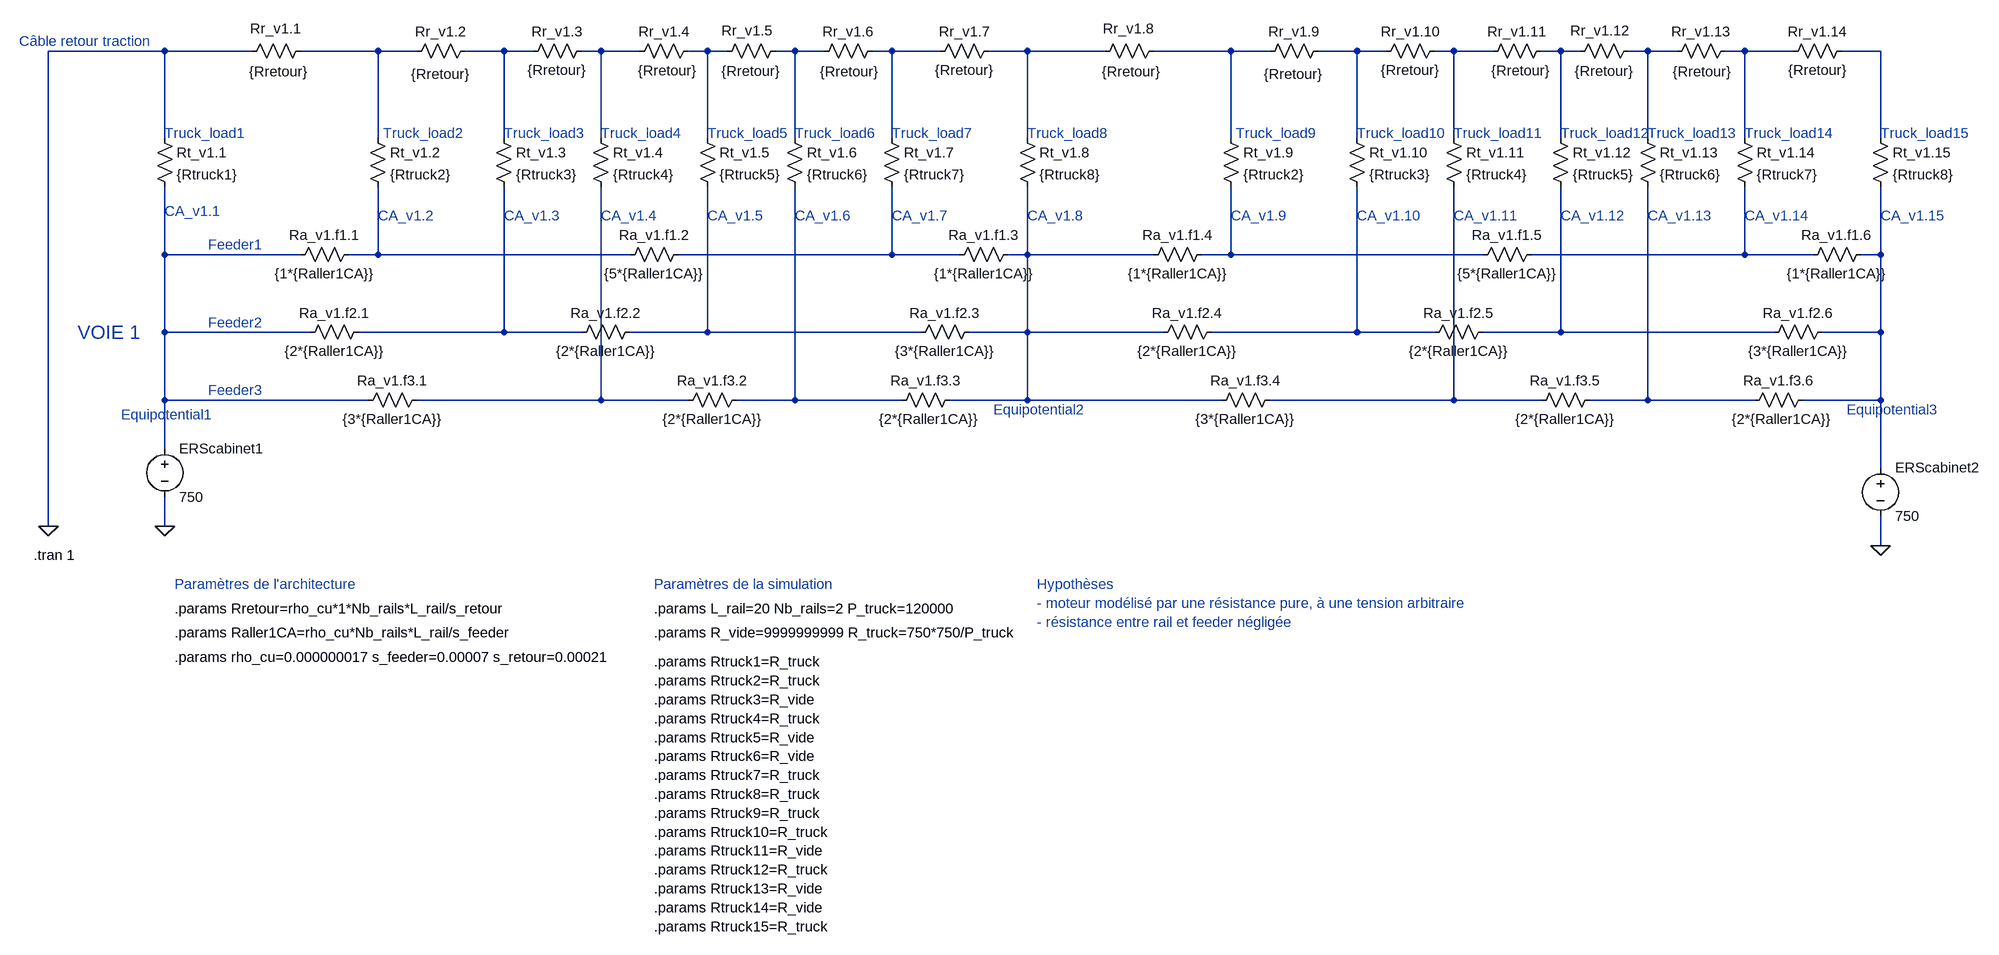
[diagram p0: schematic CA_sur_feeders.asc]
CA_sur_feeders.asc, the LTspice schematic file:
Version 4
SHEET 1 2976 1000
WIRE -48 -416 -240 -416
WIRE 96 -416 -48 -416
WIRE 304 -416 176 -416
WIRE 368 -416 304 -416
WIRE 512 -416 448 -416
WIRE 560 -416 512 -416
WIRE 672 -416 640 -416
WIRE 736 -416 672 -416
WIRE 848 -416 816 -416
WIRE 880 -416 848 -416
WIRE 992 -416 960 -416
WIRE 1040 -416 992 -416
WIRE 1152 -416 1120 -416
WIRE 1232 -416 1152 -416
WIRE 1376 -416 1312 -416
WIRE 1504 -416 1376 -416
WIRE 1712 -416 1584 -416
WIRE 1776 -416 1712 -416
WIRE 1920 -416 1856 -416
WIRE 1968 -416 1920 -416
WIRE 2080 -416 2048 -416
WIRE 2144 -416 2080 -416
WIRE 2256 -416 2224 -416
WIRE 2288 -416 2256 -416
WIRE 2400 -416 2368 -416
WIRE 2448 -416 2400 -416
WIRE 2560 -416 2528 -416
WIRE 2640 -416 2560 -416
WIRE 2784 -416 2720 -416
WIRE -48 -272 -48 -416
WIRE 304 -272 304 -416
WIRE 512 -272 512 -416
WIRE 672 -272 672 -416
WIRE 848 -272 848 -416
WIRE 992 -272 992 -416
WIRE 1152 -272 1152 -416
WIRE 1376 -272 1376 -416
WIRE 1712 -272 1712 -416
WIRE 1920 -272 1920 -416
WIRE 2080 -272 2080 -416
WIRE 2256 -272 2256 -416
WIRE 2400 -272 2400 -416
WIRE 2560 -272 2560 -416
WIRE 2784 -272 2784 -416
WIRE -48 -80 -48 -192
WIRE 176 -80 -48 -80
WIRE 304 -80 304 -192
WIRE 304 -80 256 -80
WIRE 720 -80 304 -80
WIRE 1152 -80 1152 -192
WIRE 1152 -80 800 -80
WIRE 1264 -80 1152 -80
WIRE 1376 -80 1376 -192
WIRE 1376 -80 1344 -80
WIRE 1584 -80 1376 -80
WIRE 1712 -80 1712 -192
WIRE 1712 -80 1664 -80
WIRE 2128 -80 1712 -80
WIRE 2560 -80 2560 -192
WIRE 2560 -80 2208 -80
WIRE 2672 -80 2560 -80
WIRE 2784 -80 2784 -192
WIRE 2784 -80 2752 -80
WIRE -48 48 -48 -80
WIRE 192 48 -48 48
WIRE 512 48 512 -192
WIRE 512 48 272 48
WIRE 640 48 512 48
WIRE 848 48 848 -192
WIRE 848 48 720 48
WIRE 1200 48 848 48
WIRE 1376 48 1376 -80
WIRE 1376 48 1280 48
WIRE 1600 48 1376 48
WIRE 1920 48 1920 -192
WIRE 1920 48 1680 48
WIRE 2048 48 1920 48
WIRE 2256 48 2256 -192
WIRE 2256 48 2128 48
WIRE 2608 48 2256 48
WIRE 2784 48 2784 -80
WIRE 2784 48 2688 48
WIRE -48 160 -48 48
WIRE 288 160 -48 160
WIRE 672 160 672 -192
WIRE 672 160 368 160
WIRE 816 160 672 160
WIRE 992 160 992 -192
WIRE 992 160 896 160
WIRE 1168 160 992 160
WIRE 1376 160 1376 48
WIRE 1376 160 1248 160
WIRE 1696 160 1376 160
WIRE 2080 160 2080 -192
WIRE 2080 160 1776 160
WIRE 2224 160 2080 160
WIRE 2400 160 2400 -192
WIRE 2400 160 2304 160
WIRE 2576 160 2400 160
WIRE 2784 160 2784 48
WIRE 2784 160 2656 160
WIRE -48 240 -48 160
WIRE 2784 272 2784 160
WIRE -240 368 -240 -416
WIRE -48 368 -48 320
WIRE 2784 400 2784 352
FLAG -48 368 0
FLAG -240 368 0
FLAG 2784 400 0
SYMBOL res 272 -96 R90
WINDOW 0 0 56 VBottom 2
WINDOW 3 32 56 VTop 2
SYMATTR InstName Ra_v1.f1.1
SYMATTR Value {1*{Raller1CA}}
SYMATTR SpiceLine tol=0 pwr=0
SYMBOL voltage -48 224 R0
WINDOW 123 0 0 Left 2
WINDOW 39 24 124 Left 2
SYMATTR InstName ERScabinet1
SYMATTR Value 750
SYMBOL res 288 32 R90
WINDOW 0 0 56 VBottom 2
WINDOW 3 32 56 VTop 2
SYMATTR InstName Ra_v1.f2.1
SYMATTR Value {2*{Raller1CA}}
SYMBOL res 384 144 R90
WINDOW 0 0 56 VBottom 2
WINDOW 3 32 56 VTop 2
SYMATTR InstName Ra_v1.f3.1
SYMATTR Value {3*{Raller1CA}}
SYMBOL res 736 32 R90
WINDOW 0 0 56 VBottom 2
WINDOW 3 32 56 VTop 2
SYMATTR InstName Ra_v1.f2.2
SYMATTR Value {2*{Raller1CA}}
SYMBOL res 912 144 R90
WINDOW 0 0 56 VBottom 2
WINDOW 3 32 56 VTop 2
SYMATTR InstName Ra_v1.f3.2
SYMATTR Value {2*{Raller1CA}}
SYMBOL res 816 -96 R90
WINDOW 0 0 56 VBottom 2
WINDOW 3 32 56 VTop 2
SYMATTR InstName Ra_v1.f1.2
SYMATTR Value {5*{Raller1CA}}
SYMBOL res -64 -288 R0
SYMATTR InstName Rt_v1.1
SYMATTR Value {Rtruck1}
SYMBOL res 288 -288 R0
SYMATTR InstName Rt_v1.2
SYMATTR Value {Rtruck2}
SYMBOL res 496 -288 R0
SYMATTR InstName Rt_v1.3
SYMATTR Value {Rtruck3}
SYMBOL res 656 -288 R0
SYMATTR InstName Rt_v1.4
SYMATTR Value {Rtruck4}
SYMBOL res 832 -288 R0
SYMATTR InstName Rt_v1.5
SYMATTR Value {Rtruck5}
SYMBOL res 976 -288 R0
SYMATTR InstName Rt_v1.6
SYMATTR Value {Rtruck6}
SYMBOL res 1360 -288 R0
SYMATTR InstName Rt_v1.8
SYMATTR Value {Rtruck8}
SYMBOL res 1296 32 R90
WINDOW 0 0 56 VBottom 2
WINDOW 3 32 56 VTop 2
SYMATTR InstName Ra_v1.f2.3
SYMATTR Value {3*{Raller1CA}}
SYMBOL res 1136 -288 R0
SYMATTR InstName Rt_v1.7
SYMATTR Value {Rtruck7}
SYMBOL res 1360 -96 R90
WINDOW 0 0 56 VBottom 2
WINDOW 3 32 56 VTop 2
SYMATTR InstName Ra_v1.f1.3
SYMATTR Value {1*{Raller1CA}}
SYMBOL res 1328 -432 R90
WINDOW 0 0 56 VBottom 2
WINDOW 3 32 56 VTop 2
SYMATTR InstName Rr_v1.7
SYMATTR Value {Rretour}
SYMBOL res 1136 -432 R90
WINDOW 0 0 56 VBottom 2
WINDOW 3 35 54 VTop 2
SYMATTR InstName Rr_v1.6
SYMATTR Value {Rretour}
SYMBOL res 976 -432 R90
WINDOW 0 -2 63 VBottom 2
WINDOW 3 34 56 VTop 2
SYMATTR InstName Rr_v1.5
SYMATTR Value {Rretour}
SYMBOL res 832 -432 R90
WINDOW 0 0 56 VBottom 2
WINDOW 3 33 50 VTop 2
SYMATTR InstName Rr_v1.4
SYMATTR Value {Rretour}
SYMBOL res 656 -432 R90
WINDOW 0 0 56 VBottom 2
WINDOW 3 32 56 VTop 2
SYMATTR InstName Rr_v1.3
SYMATTR Value {Rretour}
SYMBOL res 464 -432 R90
WINDOW 0 0 56 VBottom 2
WINDOW 3 39 57 VTop 2
SYMATTR InstName Rr_v1.2
SYMATTR Value {Rretour}
SYMBOL res 192 -432 R90
WINDOW 0 -5 57 VBottom 2
WINDOW 3 35 52 VTop 2
SYMATTR InstName Rr_v1.1
SYMATTR Value {Rretour}
SYMBOL res 1264 144 R90
WINDOW 0 0 56 VBottom 2
WINDOW 3 32 51 VTop 2
SYMATTR InstName Ra_v1.f3.3
SYMATTR Value {2*{Raller1CA}}
SYMBOL res 1680 -96 R90
WINDOW 0 0 56 VBottom 2
WINDOW 3 32 56 VTop 2
SYMATTR InstName Ra_v1.f1.4
SYMATTR Value {1*{Raller1CA}}
SYMATTR SpiceLine tol=0 pwr=0
SYMBOL res 1696 32 R90
WINDOW 0 0 56 VBottom 2
WINDOW 3 32 56 VTop 2
SYMATTR InstName Ra_v1.f2.4
SYMATTR Value {2*{Raller1CA}}
SYMBOL res 1792 144 R90
WINDOW 0 0 56 VBottom 2
WINDOW 3 32 56 VTop 2
SYMATTR InstName Ra_v1.f3.4
SYMATTR Value {3*{Raller1CA}}
SYMBOL res 2144 32 R90
WINDOW 0 0 56 VBottom 2
WINDOW 3 32 56 VTop 2
SYMATTR InstName Ra_v1.f2.5
SYMATTR Value {2*{Raller1CA}}
SYMBOL res 2320 144 R90
WINDOW 0 0 56 VBottom 2
WINDOW 3 32 56 VTop 2
SYMATTR InstName Ra_v1.f3.5
SYMATTR Value {2*{Raller1CA}}
SYMBOL res 2224 -96 R90
WINDOW 0 0 56 VBottom 2
WINDOW 3 32 56 VTop 2
SYMATTR InstName Ra_v1.f1.5
SYMATTR Value {5*{Raller1CA}}
SYMBOL res 1696 -288 R0
SYMATTR InstName Rt_v1.9
SYMATTR Value {Rtruck2}
SYMBOL res 1904 -288 R0
SYMATTR InstName Rt_v1.10
SYMATTR Value {Rtruck3}
SYMBOL res 2064 -288 R0
SYMATTR InstName Rt_v1.11
SYMATTR Value {Rtruck4}
SYMBOL res 2240 -288 R0
SYMATTR InstName Rt_v1.12
SYMATTR Value {Rtruck5}
SYMBOL res 2384 -288 R0
SYMATTR InstName Rt_v1.13
SYMATTR Value {Rtruck6}
SYMBOL res 2768 -288 R0
SYMATTR InstName Rt_v1.15
SYMATTR Value {Rtruck8}
SYMBOL res 2704 32 R90
WINDOW 0 0 56 VBottom 2
WINDOW 3 32 56 VTop 2
SYMATTR InstName Ra_v1.f2.6
SYMATTR Value {3*{Raller1CA}}
SYMBOL res 2544 -288 R0
SYMATTR InstName Rt_v1.14
SYMATTR Value {Rtruck7}
SYMBOL res 2768 -96 R90
WINDOW 0 0 56 VBottom 2
WINDOW 3 32 56 VTop 2
SYMATTR InstName Ra_v1.f1.6
SYMATTR Value {1*{Raller1CA}}
SYMBOL res 2736 -432 R90
WINDOW 0 0 56 VBottom 2
WINDOW 3 32 56 VTop 2
SYMATTR InstName Rr_v1.14
SYMATTR Value {Rretour}
SYMBOL res 2544 -432 R90
WINDOW 0 0 56 VBottom 2
WINDOW 3 35 54 VTop 2
SYMATTR InstName Rr_v1.13
SYMATTR Value {Rretour}
SYMBOL res 2384 -432 R90
WINDOW 0 -2 63 VBottom 2
WINDOW 3 34 56 VTop 2
SYMATTR InstName Rr_v1.12
SYMATTR Value {Rretour}
SYMBOL res 2240 -432 R90
WINDOW 0 0 56 VBottom 2
WINDOW 3 33 50 VTop 2
SYMATTR InstName Rr_v1.11
SYMATTR Value {Rretour}
SYMBOL res 2064 -432 R90
WINDOW 0 0 56 VBottom 2
WINDOW 3 32 56 VTop 2
SYMATTR InstName Rr_v1.10
SYMATTR Value {Rretour}
SYMBOL res 1872 -432 R90
WINDOW 0 0 56 VBottom 2
WINDOW 3 39 57 VTop 2
SYMATTR InstName Rr_v1.9
SYMATTR Value {Rretour}
SYMBOL res 1600 -432 R90
WINDOW 0 -5 57 VBottom 2
WINDOW 3 35 52 VTop 2
SYMATTR InstName Rr_v1.8
SYMATTR Value {Rretour}
SYMBOL res 2672 144 R90
WINDOW 0 0 56 VBottom 2
WINDOW 3 32 51 VTop 2
SYMATTR InstName Ra_v1.f3.6
SYMATTR Value {2*{Raller1CA}}
SYMBOL voltage 2784 256 R0
WINDOW 123 0 0 Left 2
WINDOW 39 24 124 Left 2
SYMATTR InstName ERScabinet2
SYMATTR Value 750
TEXT 304 -144 Left 2 ;CA_v1.2
TEXT -48 -152 Left 2 ;CA_v1.1
TEXT 512 -144 Left 2 ;CA_v1.3
TEXT 672 -144 Left 2 ;CA_v1.4
TEXT 848 -144 Left 2 ;CA_v1.5
TEXT 992 -144 Left 2 ;CA_v1.6
TEXT 1376 -144 Left 2 ;CA_v1.8
TEXT -48 -280 Left 2 ;Truck_load1
TEXT 312 -280 Left 2 ;Truck_load2
TEXT 512 -280 Left 2 ;Truck_load3
TEXT 672 -280 Left 2 ;Truck_load4
TEXT 848 -280 Left 2 ;Truck_load5
TEXT 992 -280 Left 2 ;Truck_load6
TEXT 1376 -280 Left 2 ;Truck_load8
TEXT 1320 176 Left 2 ;Equipotential2
TEXT -120 184 Left 2 ;Equipotential1
TEXT 24 144 Left 2 ;Feeder3
TEXT 24 32 Left 2 ;Feeder2
TEXT 24 -96 Left 2 ;Feeder1
TEXT 760 504 Left 2 !.params L_rail=20 Nb_rails=2 P_truck=120000
TEXT -264 416 Left 2 !.tran 1
TEXT 1152 -280 Left 2 ;Truck_load7
TEXT 1152 -144 Left 2 ;CA_v1.7
TEXT -288 -432 Left 2 ;Câble retour traction
TEXT 760 544 Left 2 !.params R_vide=9999999999 R_truck=750*750/P_truck
TEXT 760 592 Left 2 !.params Rtruck1=R_truck\n.params Rtruck2=R_truck\n.params Rtruck3=R_vide \n.params Rtruck4=R_truck\n.params Rtruck5=R_vide\n.params Rtruck6=R_vide\n.params Rtruck7=R_truck\n.params Rtruck8=R_truck\n.params Rtruck9=R_truck\n.params Rtruck10=R_truck\n.params Rtruck11=R_vide \n.params Rtruck12=R_truck\n.params Rtruck13=R_vide\n.params Rtruck14=R_vide\n.params Rtruck15=R_truck
TEXT -32 504 Left 2 !.params Rretour=rho_cu*1*Nb_rails*L_rail/s_retour
TEXT -32 544 Left 2 !.params Raller1CA=rho_cu*Nb_rails*L_rail/s_feeder
TEXT -192 48 Left 3 ;VOIE 1
TEXT -32 464 Left 2 ;Paramètres de l'architecture
TEXT -32 584 Left 2 !.params rho_cu=0.000000017 s_feeder=0.00007 s_retour=0.00021
TEXT 760 464 Left 2 ;Paramètres de la simulation
TEXT 1392 464 Left 2 ;Hypothèses\n- moteur modélisé par une résistance pure, à une tension arbitraire\n- résistance entre rail et feeder négligée
TEXT 1712 -144 Left 2 ;CA_v1.9
TEXT 1920 -144 Left 2 ;CA_v1.10
TEXT 2080 -144 Left 2 ;CA_v1.11
TEXT 2256 -144 Left 2 ;CA_v1.12
TEXT 2400 -144 Left 2 ;CA_v1.13
TEXT 2784 -144 Left 2 ;CA_v1.15
TEXT 1720 -280 Left 2 ;Truck_load9
TEXT 1920 -280 Left 2 ;Truck_load10
TEXT 2080 -280 Left 2 ;Truck_load11
TEXT 2256 -280 Left 2 ;Truck_load12
TEXT 2400 -280 Left 2 ;Truck_load13
TEXT 2784 -280 Left 2 ;Truck_load15
TEXT 2728 176 Left 2 ;Equipotential3
TEXT 2560 -280 Left 2 ;Truck_load14
TEXT 2560 -144 Left 2 ;CA_v1.14

The netlist it stands for:
* CA_sur_feeders.asc
Ra_v1.f1.1 N016 N015 {1*{Raller1CA}} tol=0 pwr=0
V§ERScabinet1 N015 0 750
Ra_v1.f2.1 N022 N015 {2*{Raller1CA}}
Ra_v1.f3.1 N026 N015 {3*{Raller1CA}}
Ra_v1.f2.2 N023 N022 {2*{Raller1CA}}
Ra_v1.f3.2 N027 N026 {2*{Raller1CA}}
Ra_v1.f1.2 N017 N016 {5*{Raller1CA}}
Rt_v1.1 0 N015 {Rtruck1}
Rt_v1.2 N001 N016 {Rtruck2}
Rt_v1.3 N002 N022 {Rtruck3}
Rt_v1.4 N003 N026 {Rtruck4}
Rt_v1.5 N004 N023 {Rtruck5}
Rt_v1.6 N005 N027 {Rtruck6}
Rt_v1.8 N007 N018 {Rtruck8}
Ra_v1.f2.3 N018 N023 {3*{Raller1CA}}
Rt_v1.7 N006 N017 {Rtruck7}
Ra_v1.f1.3 N018 N017 {1*{Raller1CA}}
Rr_v1.7 N007 N006 {Rretour}
Rr_v1.6 N006 N005 {Rretour}
Rr_v1.5 N005 N004 {Rretour}
Rr_v1.4 N004 N003 {Rretour}
Rr_v1.3 N003 N002 {Rretour}
Rr_v1.2 N002 N001 {Rretour}
Rr_v1.1 N001 0 {Rretour}
Ra_v1.f3.3 N018 N027 {2*{Raller1CA}}
Ra_v1.f1.4 N019 N018 {1*{Raller1CA}} tol=0 pwr=0
Ra_v1.f2.4 N024 N018 {2*{Raller1CA}}
Ra_v1.f3.4 N028 N018 {3*{Raller1CA}}
Ra_v1.f2.5 N025 N024 {2*{Raller1CA}}
Ra_v1.f3.5 N029 N028 {2*{Raller1CA}}
Ra_v1.f1.5 N020 N019 {5*{Raller1CA}}
Rt_v1.9 N008 N019 {Rtruck2}
Rt_v1.10 N009 N024 {Rtruck3}
Rt_v1.11 N010 N028 {Rtruck4}
Rt_v1.12 N011 N025 {Rtruck5}
Rt_v1.13 N012 N029 {Rtruck6}
Rt_v1.15 N014 N021 {Rtruck8}
Ra_v1.f2.6 N021 N025 {3*{Raller1CA}}
Rt_v1.14 N013 N020 {Rtruck7}
Ra_v1.f1.6 N021 N020 {1*{Raller1CA}}
Rr_v1.14 N014 N013 {Rretour}
Rr_v1.13 N013 N012 {Rretour}
Rr_v1.12 N012 N011 {Rretour}
Rr_v1.11 N011 N010 {Rretour}
Rr_v1.10 N010 N009 {Rretour}
Rr_v1.9 N009 N008 {Rretour}
Rr_v1.8 N008 N007 {Rretour}
Ra_v1.f3.6 N021 N029 {2*{Raller1CA}}
V§ERScabinet2 N021 0 750
* CA_v1.2
* CA_v1.1
* CA_v1.3
* CA_v1.4
* CA_v1.5
* CA_v1.6
* CA_v1.8
* Truck_load1
* Truck_load2
* Truck_load3
* Truck_load4
* Truck_load5
* Truck_load6
* Truck_load8
* Equipotential2
* Equipotential1
* Feeder3
* Feeder2
* Feeder1
.params L_rail=20 Nb_rails=2 P_truck=120000
.tran 1
* Truck_load7
* CA_v1.7
* Câble retour traction
.params R_vide=9999999999 R_truck=750*750/P_truck
.params Rtruck1=R_truck
.params Rtruck2=R_truck
.params Rtruck3=R_vide
.params Rtruck4=R_truck
.params Rtruck5=R_vide
.params Rtruck6=R_vide
.params Rtruck7=R_truck
.params Rtruck8=R_truck
.params Rtruck9=R_truck
.params Rtruck10=R_truck
.params Rtruck11=R_vide
.params Rtruck12=R_truck
.params Rtruck13=R_vide
.params Rtruck14=R_vide
.params Rtruck15=R_truck
.params Rretour=rho_cu*1*Nb_rails*L_rail/s_retour
.params Raller1CA=rho_cu*Nb_rails*L_rail/s_feeder
* VOIE 1
* Paramètres de l'architecture
.params rho_cu=0.000000017 s_feeder=0.00007 s_retour=0.00021
* Paramètres de la simulation
* Hypothèses
* - moteur modélisé par une résistance pure, à une tension arbitraire
* - résistance entre rail et feeder négligée
* CA_v1.9
* CA_v1.10
* CA_v1.11
* CA_v1.12
* CA_v1.13
* CA_v1.15
* Truck_load9
* Truck_load10
* Truck_load11
* Truck_load12
* Truck_load13
* Truck_load15
* Equipotential3
* Truck_load14
* CA_v1.14
.backanno
.end